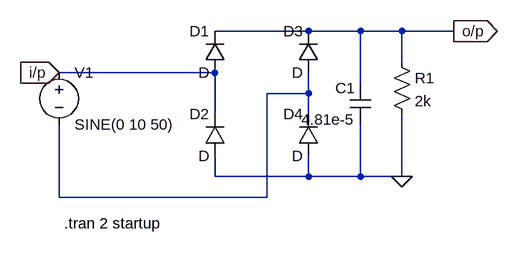
[diagram p0: schematic 2.Full Wave Rectifier.asc]
2.Full Wave Rectifier.asc, the LTspice schematic file:
Version 4
SHEET 1 900 680
WIRE 336 96 192 96
WIRE 416 96 336 96
WIRE 480 96 416 96
WIRE 560 96 480 96
WIRE 480 144 480 96
WIRE 192 160 -48 160
WIRE 416 176 416 96
WIRE 336 192 336 160
WIRE 336 192 272 192
WIRE 192 224 192 160
WIRE 336 224 336 192
WIRE 192 320 192 288
WIRE 336 320 336 288
WIRE 336 320 192 320
WIRE 416 320 416 240
WIRE 416 320 336 320
WIRE 480 320 480 224
WIRE 480 320 416 320
WIRE -48 352 -48 240
WIRE 272 352 272 192
WIRE 272 352 -48 352
FLAG 560 96 o/p
IOPIN 560 96 Out
FLAG 480 320 0
FLAG -48 160 i/p
IOPIN -48 160 In
SYMBOL diode 208 160 R180
WINDOW 0 24 64 Left 2
WINDOW 3 24 0 Left 2
SYMATTR InstName D1
SYMBOL diode 208 288 R180
WINDOW 0 24 64 Left 2
WINDOW 3 24 0 Left 2
SYMATTR InstName D2
SYMBOL diode 352 160 R180
WINDOW 0 24 64 Left 2
WINDOW 3 24 0 Left 2
SYMATTR InstName D3
SYMBOL diode 352 288 R180
WINDOW 0 24 64 Left 2
WINDOW 3 24 0 Left 2
SYMATTR InstName D4
SYMBOL res 464 128 R0
SYMATTR InstName R1
SYMATTR Value 2k
SYMBOL voltage -48 144 R0
WINDOW 123 0 0 Left 0
WINDOW 39 0 0 Left 0
SYMATTR InstName V1
SYMATTR Value SINE(0 10 50)
SYMBOL cap 432 240 R180
WINDOW 0 24 56 Left 2
WINDOW 3 24 8 Left 2
SYMATTR InstName C1
SYMATTR Value 4.81e-5
TEXT -40 392 Left 2 !.tran 2 startup

The netlist it stands for:
* 2.Full Wave Rectifier.asc
D1 i/p o/p D
D2 0 i/p D
D3 N001 o/p D
D4 0 N001 D
R1 o/p 0 2k
V1 i/p N001 SINE(0 10 50)
C1 0 o/p 4.81e-5
.model D D
.lib standard.dio
.tran 2 startup
.backanno
.end